# Altium project Sampling_Board5.24.PrjPcb
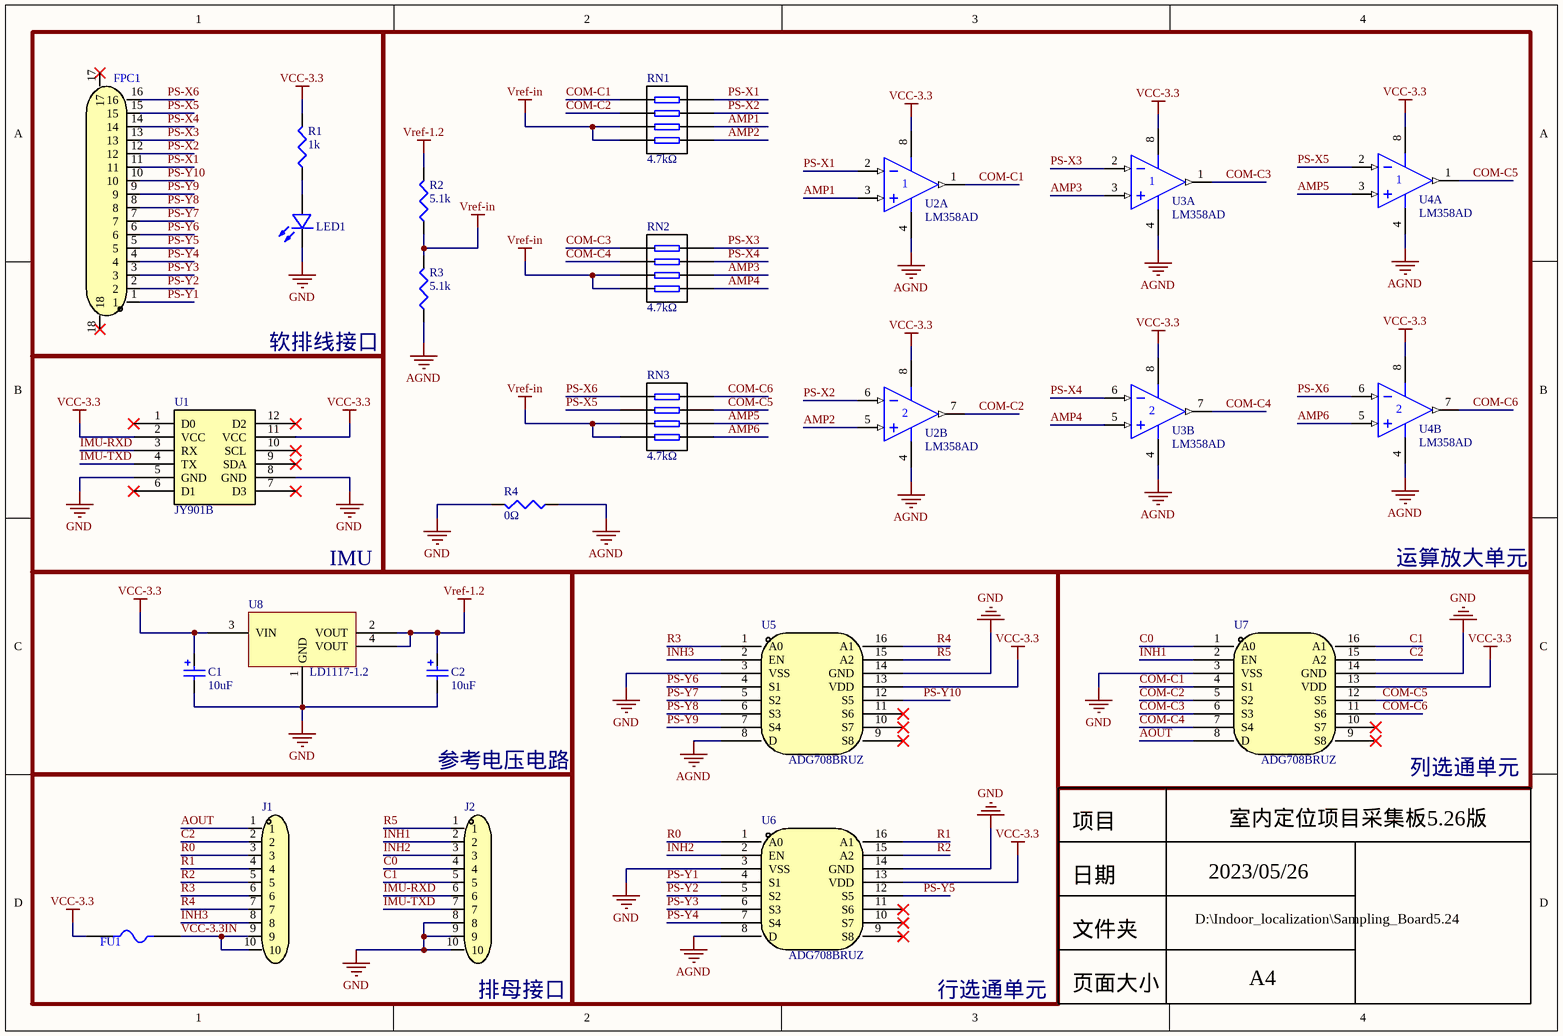
[diagram p0: Sampling_Board.SchDoc]
1 sheet, 22 parts. Net scope: global (net labels, ports and power ports of the same name join across sheets).
Board file: Sampling_Board.PcbDoc

## Sheet Sampling_Board.SchDoc
size A4; SheetNumber: 1; SheetTotal: 1

### Parts
C1  value 10uF  [CAP-SMD_L3.2-W1.6-RD-C7171]  (hidden comment: TAJA106K016RNJ)
C2  value 10uF  [CAP-SMD_L3.2-W1.6-RD-C7171]  (hidden comment: TAJA106K016RNJ)
FPC1  1.0K-DX-16PWB  [FPC-SMD_16P-P1.00_HDGC_1.0K-DX-16PWB]  (value not drawn)
FU1  FUSE 1A  [F0805]  (value not drawn)
J1  Header 10X1  [HDR-TH_10P-P2.54_MF254V-11-10-0743]  (value not drawn)
J2  Header 10X1  [HDR-TH_10P-P2.54_MF254V-11-10-0743]  (value not drawn)
LED1  NCD0603G2  [LED0603-RD]  (value not drawn)
R1  1k  [R0603]
R2  5.1k  [R0603]
R3  5.1k  [R0603]
R4  0Ω  [R0603]
RN1  value 4.7kΩ  [RES-ARRAY-SMD_0603-8P-L3.2-W1.6-BL]  (hidden comment: Res*4)
RN2  value 4.7kΩ  [RES-ARRAY-SMD_0603-8P-L3.2-W1.6-BL]  (hidden comment: Res*4)
RN3  value 4.7kΩ  [RES-ARRAY-SMD_0603-8P-L3.2-W1.6-BL]  (hidden comment: Res*4)
U1  JY901B  [JY901B]
U2  LM358AD  [D008_L]  (parts A,B of 2)
U3  LM358AD  [D008_L]  (parts A,B of 2)
U4  LM358AD  [D008_L]  (parts A,B of 2)
U5  ADG708BRUZ  [TSSOP-16_L5.0-W4.4-P0.65-LS6.4-BL]
U6  ADG708BRUZ  [TSSOP-16_L5.0-W4.4-P0.65-LS6.4-BL]
U7  ADG708BRUZ  [TSSOP-16_L5.0-W4.4-P0.65-LS6.4-BL]
U8  LD1117-1.2  [SOT-223-3_L6.5-W3.4-P2.30-LS7.0-BR]

### Blocks framed on the sheet
软排线接口: FPC1 LED1 R1
运算放大单元: R2-R4 RN1-RN3 U2-U4

### Nets
AGND: R3.1 R4.1 U2.4(V-) U3.4(V-) U4.4(V-) U5.8(D) U6.8(D)
GND: C1.2 C2.2 J2.8 J2.9 J2.10 LED1.1(K) R4.2 U1.5(GND) U1.8(GND) U5.3(VSS) U5.14(GND) U6.3(VSS) U6.14(GND) U7.3(VSS) U7.14(GND) U8.1(GND)
VCC-3.3: C1.1 FU1.1 R1.2 U1.2(VCC) U1.11(VCC) U2.8(V+) U3.8(V+) U4.8(V+) U5.13(VDD) U6.13(VDD) U7.13(VDD) U8.3(VIN)
Vref-1.2: C2.1 R2.2 U8.2(VOUT) U8.4(VOUT)
Vref-in: R2.1 R3.2 RN1.7 RN1.8 RN2.7 RN2.8 RN3.7 RN3.8
AMP1: RN1.2 U2.3(IN+)
AMP2: RN1.1 U2.5(IN+)
AMP3: RN2.2 U3.3(IN+)
AMP4: RN2.1 U3.5(IN+)
AMP5: RN3.2 U4.3(IN+)
AMP6: RN3.1 U4.5(IN+)
AOUT: J1.1 U7.8(D)
C0: J2.4 U7.1(A0)
C1: J2.5 U7.16(A1)
C2: J1.2 U7.15(A2)
COM-C1: RN1.5 U2.1(OUT) U7.4(S1)
COM-C2: RN1.6 U2.7(OUT) U7.5(S2)
COM-C3: RN2.5 U3.1(OUT) U7.6(S3)
COM-C4: RN2.6 U3.7(OUT) U7.7(S4)
COM-C5: RN3.3 U4.1(OUT) U7.12(S5)
COM-C6: RN3.4 U4.7(OUT) U7.11(S6)
IMU-RXD: J2.6 U1.3(RX)
IMU-TXD: J2.7 U1.4(TX)
INH1: J2.2 U7.2(EN)
INH2: J2.3 U6.2(EN)
INH3: J1.8 U5.2(EN)
PS-X1: FPC1.11 RN1.4 U2.2(IN-)
PS-X2: FPC1.12 RN1.3 U2.6(IN-)
PS-X3: FPC1.13 RN2.4 U3.2(IN-)
PS-X4: FPC1.14 RN2.3 U3.6(IN-)
PS-X5: FPC1.15 RN3.6 U4.2(IN-)
PS-X6: FPC1.16 RN3.5 U4.6(IN-)
PS-Y1: FPC1.1 U6.4(S1)
PS-Y2: FPC1.2 U6.5(S2)
PS-Y3: FPC1.3 U6.6(S3)
PS-Y4: FPC1.4 U6.7(S4)
PS-Y5: FPC1.5 U6.12(S5)
PS-Y6: FPC1.6 U5.4(S1)
PS-Y7: FPC1.7 U5.5(S2)
PS-Y8: FPC1.8 U5.6(S3)
PS-Y9: FPC1.9 U5.7(S4)
PS-Y10: FPC1.10 U5.12(S5)
R0: J1.3 U6.1(A0)
R1: J1.4 U6.16(A1)
R2: J1.5 U6.15(A2)
R3: J1.6 U5.1(A0)
R4: J1.7 U5.16(A1)
R5: J2.1 U5.15(A2)
VCC-3.3IN: FU1.2 J1.9 J1.10
NetLED1_2: LED1.2(A) R1.1

Not connected (* = marked no-connect by the designer): FPC1 17* 18*; U1 1(D0)* 6(D1)* 7(D3)* 9(SDA)* 10(SCL)* 12(D2)*; U5 9(S8)* 10(S7)* 11(S6)*; U6 9(S8)* 10(S7)* 11(S6)*; U7 9(S8)* 10(S7)*

### Notes on the sheet
- IMU
- 参考电压电路
- 列选通单元
- 项目
- 室内定位项目采集板5.26版
- 日期
- 2023/05/26
- 文件夹
- D:\Indoor_localization\Sampling_Board5.24
- A4
- (near J2) 排母接口
- 行选通单元
- 页面大小

### Library data of the parts
C1 C2 = Cap-TAJA: 贴片钽电容; Manufacturer: Kyocera AVX; Add into BOM: yes; Tolerance: ±10%; Rated Voltage: 16V; Equivalent Series Resistance(ESR): 3Ω@100kHz; Name: 10uF; Symbol: TAJA106K016RNJ; Device: TAJA106K016RNJ; LCSC Part Name: 10uF ±10% 16V; Supplier Part: C7171; Manufacturer Part: TAJA106K016RNJ; Supplier Footprint: CASE-A-3216; JLCPCB Part Class: Basic Part; Datasheet: https://atta.szlcsc.com/upload/public/pdf/source/20160107/1457707748093.pdf; Supplier: LCSC; Convert to PCB: yes; Operating Temperature: -55℃~+125℃
FPC1 = FPC16P: 软排线接口16P; Manufacturer: HDGC(华德共创); Add into BOM: yes; Pitch: 1mm; Number of Contacts: 16; Locking Feature: 翻盖式; FFC, FCB Thickness: 0.3mm; Name: 1.0K-DX-16PWB; Symbol: 1.0K-DX-16PWB; Device: 1.0K-DX-16PWB; LCSC Part Name: 1mm P数:16 翻盖式 下接 D型; Supplier Part: C2915447; Manufacturer Part: 1.0K-DX-16PWB; Supplier Footprint: SMD,P=1mm; JLCPCB Part Class: Extended Part; Datasheet: https://atta.szlcsc.com/upload/public/pdf/source/20211109/20C01A8270A5DB2C0F8B9DB944B0755A.pdf; Supplier: LCSC; Convert to PCB: yes; Mounting Type: 卧贴; Contact Type: 下接; Height Above Board: 2mm; Operating Temperature Range: -20℃~+85℃
FU1 = FU: 贴片保险丝; Manufacturer: RUILON(瑞隆源); Name: SMD0805P075TF; Device: SMD0805P075TF_C20979; Add into BOM: yes; Operating Voltage (Max): 6V; Current Rating (Max): 40A; Hold Current: 750mA; Trip Current: 1.5A; Symbol: SMD0805P075TF; LCSC Part Name: 6V 750mA 0805自恢复; Supplier Part: C20979; Manufacturer Part: SMD0805P075TF; Supplier Footprint: 0805; JLCPCB Part Class: Extended Part; Datasheet: https://atta.szlcsc.com/upload/public/pdf/source/20140222/1457706788789.pdf; Supplier: LCSC; Convert to PCB: yes
J1 J2 = Header 10X1: 10P*1接插件; Symbol: MF254V-11-10-1000-H70; Designer: U?; Device: MF254V-11-10-1000-H70
LED1 = NCD0603G2: LED; Manufacturer: 国星光电; Symbol: FC-1608UGK-520D; Add into BOM: yes; Emitted Color: 翠绿; Name: NCD0603G2; Device: NCD0603G2; LCSC Part Name: 翠绿; Supplier Part: C87326; Manufacturer Part: NCD0603G2; Supplier Footprint: 0603; JLCPCB Part Class: Extended Part; Datasheet: https://atta.szlcsc.com/upload/public/pdf/source/20200820/C87326_434E337B13CFAB9A1423E0838CFDDDAC.pdf; Supplier: LCSC; Convert to PCB: yes
R1-R4 = Res3: Resistor; Published: 8-Jun-2000; LatestRevisionDate: 29-May-2009; LatestRevisionNote: IPC-7351 Footprint Added.; PackageReference: J1-0603; Publisher: Altium Limited; PackageDescription: Chip Resistor
RN1-RN3 = Res*4: 贴片排阻*4; Manufacturer: FH(风华); Symbol: RC-ML08W103JT; Add into BOM: yes; Tolerance: ±5%; Power(Watts): 62.5mW; Number of Resistors: 4; Temperature Coefficient: ±100ppm/℃; Name: 4.7kΩ; Device: RC-ML08W103JT; LCSC Part Name: 10kΩ ±5%; Supplier Part: C69593; Manufacturer Part: RC-ML08W103JT; Supplier Footprint: 0603x4; JLCPCB Part Class: Extended Part; Datasheet: https://atta.szlcsc.com/upload/public/pdf/source/20171225/C69593_15141884772841203313.pdf; Supplier: LCSC; Convert to PCB: yes; Number of Pins: 8
U1 = JY901B: Ten axis inertial sensor
U2-U4 = LM358AD: Dual Operational Amplifier; Published: 15-Apr-2002; LatestRevisionDate: 13-Apr-2006; LatestRevisionNote: IPC-7351 Footprint Added.; DatasheetVersion: Aug-1988; PackageVersion: Jan-1998; PackageReference: D008; Publisher: Altium Limited; PackageDescription: 8-Pin Small Outline Integrated Circuit 1.27 mm Pitch; Code_IPC: SOIC127P600-8; ComponentLink1Description: Manufacturer Link; ComponentLink1URL: http://www.ti.com/; ComponentLink2Description: Datasheet; ComponentLink2URL: http://www-s.ti.com/sc/ds/lm358.pdf
U5-U7 = ADG708BRUZ: 低电压8通道多路复用器; Manufacturer: ADI(亚德诺)/LINEAR(凌特); Symbol: ADG708BRUZ_C579091; Add into BOM: yes; Name: ADG708BRUZ; Device: ADG708BRUZ; LCSC Part Name: ADG708BRUZ; Supplier Part: C579091; Manufacturer Part: ADG708BRUZ; Supplier Footprint: TSSOP-16; JLCPCB Part Class: Extended Part; Datasheet: https://atta.szlcsc.com/upload/public/pdf/source/20180613/C206785_93B0E46C728EF6F994EE56115A1D5409.pdf; Supplier: LCSC; Convert to PCB: yes
U8 = LD1117-1.2: 低压差线性稳压器1.2V